# Altium schematic sheet USB_OTG_FS.SchDoc: USB_OTG_FS
size A4; DocumentNumber: 5; SheetNumber: 6; SheetTotal: 7
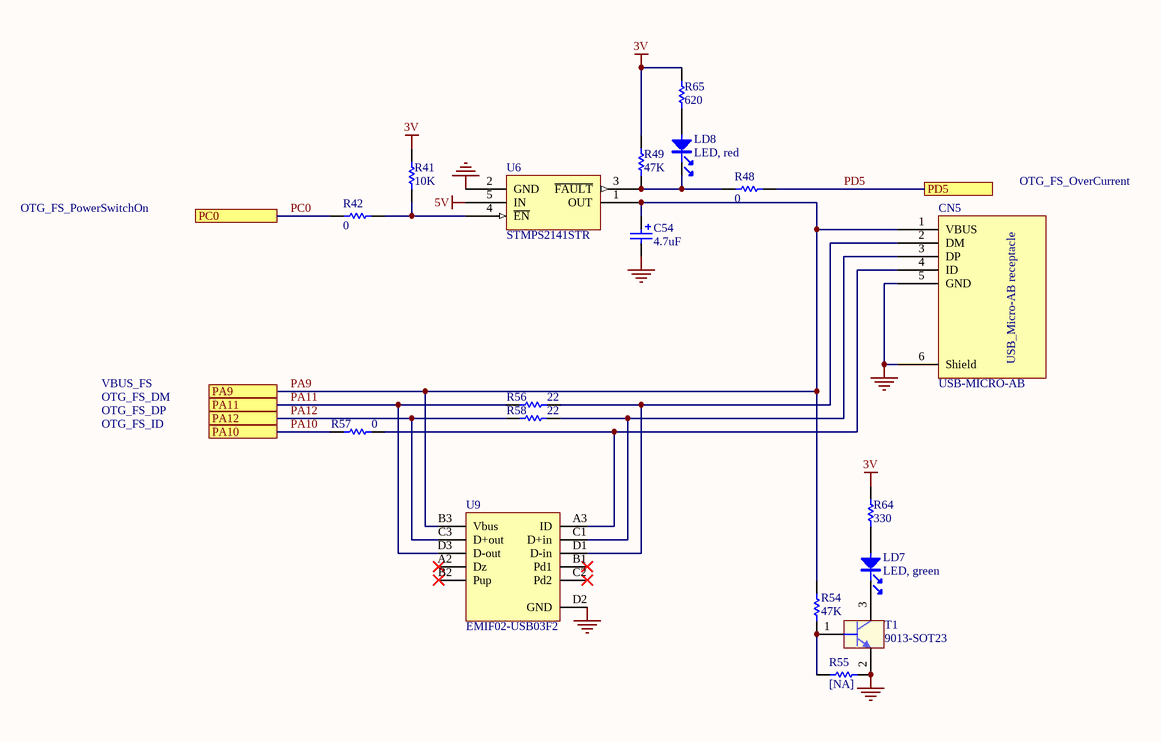
[diagram p0: USB_OTG_FS.SchDoc]

## Parts
C54  4.7uF  [TAN-A (Primary)]
CN5  USB-MICRO-AB  [USB-MICRO-AB (Primary)]
LD7  LED, green  [0603D (Primary)]
LD8  LED, red  [0603D (Primary)]
R41  10K  [0402R (Primary)]
R42  0  [0402R (Primary)]
R48  0  [0402R (Primary)]
R49  47K  [0402R (Primary)]
R54  47K  [0402R (Primary)]
R55  [NA]  [0402R (Primary)]
R56  22  [0402R (Primary)]
R57  0  [0402R (Primary)]
R58  22  [0402R (Primary)]
R64  330  [0603R (Primary)]
R65  620  [0603R (Primary)]
T1  9013-SOT23  [SOT23 (Primary)]
U6  STMPS2141STR  [SOT23-5L (Primary)]
U9  EMIF02-USB03F2  [Flip Chip (Primary)]

## Ports
PA9, PA10, PA11, PA12, PC0, PD5

## Nets
3V: R41.1 R49.1 R64.2 R65.2
5V: U6.5(IN)
GND: C54.2 CN5.5(GND) CN5.6(Shield) R55.2 T1.2(E) U6.2(GND) U9.D2(GND)
PA9: C54.1 CN5.1(VBUS) R54.2 U6.1(OUT) U9.B3(Vbus) ; port PA9
PA10: R57.1 ; port PA10
PA11: R56.2 U9.D3(D-out) ; port PA11
PA12: R58.2 U9.C3(D+out) ; port PA12
PC0: R42.1 ; port PC0
PD5: R48.2 ; port PD5
NetCN5_2: CN5.2(DM) R56.1 U9.D1(D-in)
NetCN5_3: CN5.3(DP) R58.1 U9.C1(D+in)
NetCN5_4: CN5.4(ID) R57.2 U9.A3(ID)
NetLD7_1: LD7.1 R64.1
NetLD7_2: LD7.2 T1.3(C)
NetLD8_1: LD8.1 R65.1
NetLD8_2: LD8.2 R48.1 R49.2 U6.3(~{FAULT})
NetR41_2: R41.2 R42.2 U6.4(~{EN})
NetR54_1: R54.1 R55.1 T1.1(B)

Not connected (* = marked no-connect by the designer): U9 A2(Dz)* B1(Pd1)* B2(Pup)* C2(Pd2)*

## Notes on the sheet
- OTG_FS_PowerSwitchOn
- OTG_FS_OverCurrent
- VBUS_FS
- OTG_FS_ID
- OTG_FS_DM
- OTG_FS_DP
- Title:
- Project:
- Size:
- Revision:
- Variant:
- A4
- -
- Date:
- Reference:
- Sheet:
- of
- (in symbol USB-MICRO-AB) USB_Micro-AB receptacle

## Library data of the parts
C54 = Cap_4.7uF_POL_10%_TANA: Polarized Capacitor,4.7uF,16V,10%,typeA,AVX; Manuf_Part_1: TAJA475K016R; Revision: July-2002: Re-released for DXP Platform.; Value: 4.7uF; Manuf_1: AVX; Order: TAJA475K016R
CN5 = USB-MICRO-AB: USB-MICRO-AB, 47590-0001, SMT, MOLEX; Ref St: xxxxxxx; Manuf_1: MOLEX; Manuf_Part_1: 47590-0001; ECCN_US/EU: *; Distrib: *
LD7 = LED_green: LED, green, 0603; Manuf_1: everlight; Manuf_Part_1: 19-213SYGC/S530-E2/TR8; Order: 19-213SYGC/S530-E2/TR8
LD8 = LED_red: LED, red, 0603; Manuf_1: everlight; Manuf_Part_1: 19-213-R6C-AP1Q2B/3T; Order: 19-213-R6C-AP1Q2B/3T
R41 R49 R54 R64 = res1: Resistor; Value: 1K; Published: 8-Jun-2000; Revision: July-2002: Re-released for DXP Platform.; Publisher: Altium Limited
R42 R48 R57 = Res_0_0402: Resistor,0,0402; Value: 0
R55 = Res_NA_0402: Resistor,[NA],0402; Fitted: NO; Value: [NA]
R56 R58 R65 = Res1: Resistor; Value: 1K; Published: 8-Jun-2000; Revision: July-2002: Re-released for DXP Platform.; Publisher: Altium Limited
T1 = 9013-SOT23: NPN Bipolar Transistor; Manuf_1: unisonic; Manuf_Part_1: MMBT9013; Revision: July-2002: Re-released for DXP Platform.; Order: MMBT9013
U6 = STMPS2141STR: Enhanced single channel power switches; Manuf_1: STM; Provided: ST; ECCN_US/EU: EAR99/NEC; Ref St: 9159003; Order: STMPS2141STR; Manuf_Part_1: STMPS2141STR; Distrib: ST
U9 = EMIF02-USB03F2: 2-line IPAD, EMI filter including ESD protection; Manuf_1: STM; Provided: ST; ECCN_US/EU: EAR99/NEC; Ref St: 9179037; Order: EMIF02-USB03F2; Manuf_Part_1: EMIF02-USB03F2; Distrib: ST